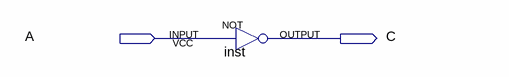
[diagram p0: schematic sheet]
// Quartus schematic NOT_VHDL.bdf as structural Verilog: 1 symbols, 2 pins
module NOT_VHDL (
  input  A,
  output C
);

  not inst (C, A);
endmodule
